# EAGLE design WatchdogTimer (EAGLE 6.3)
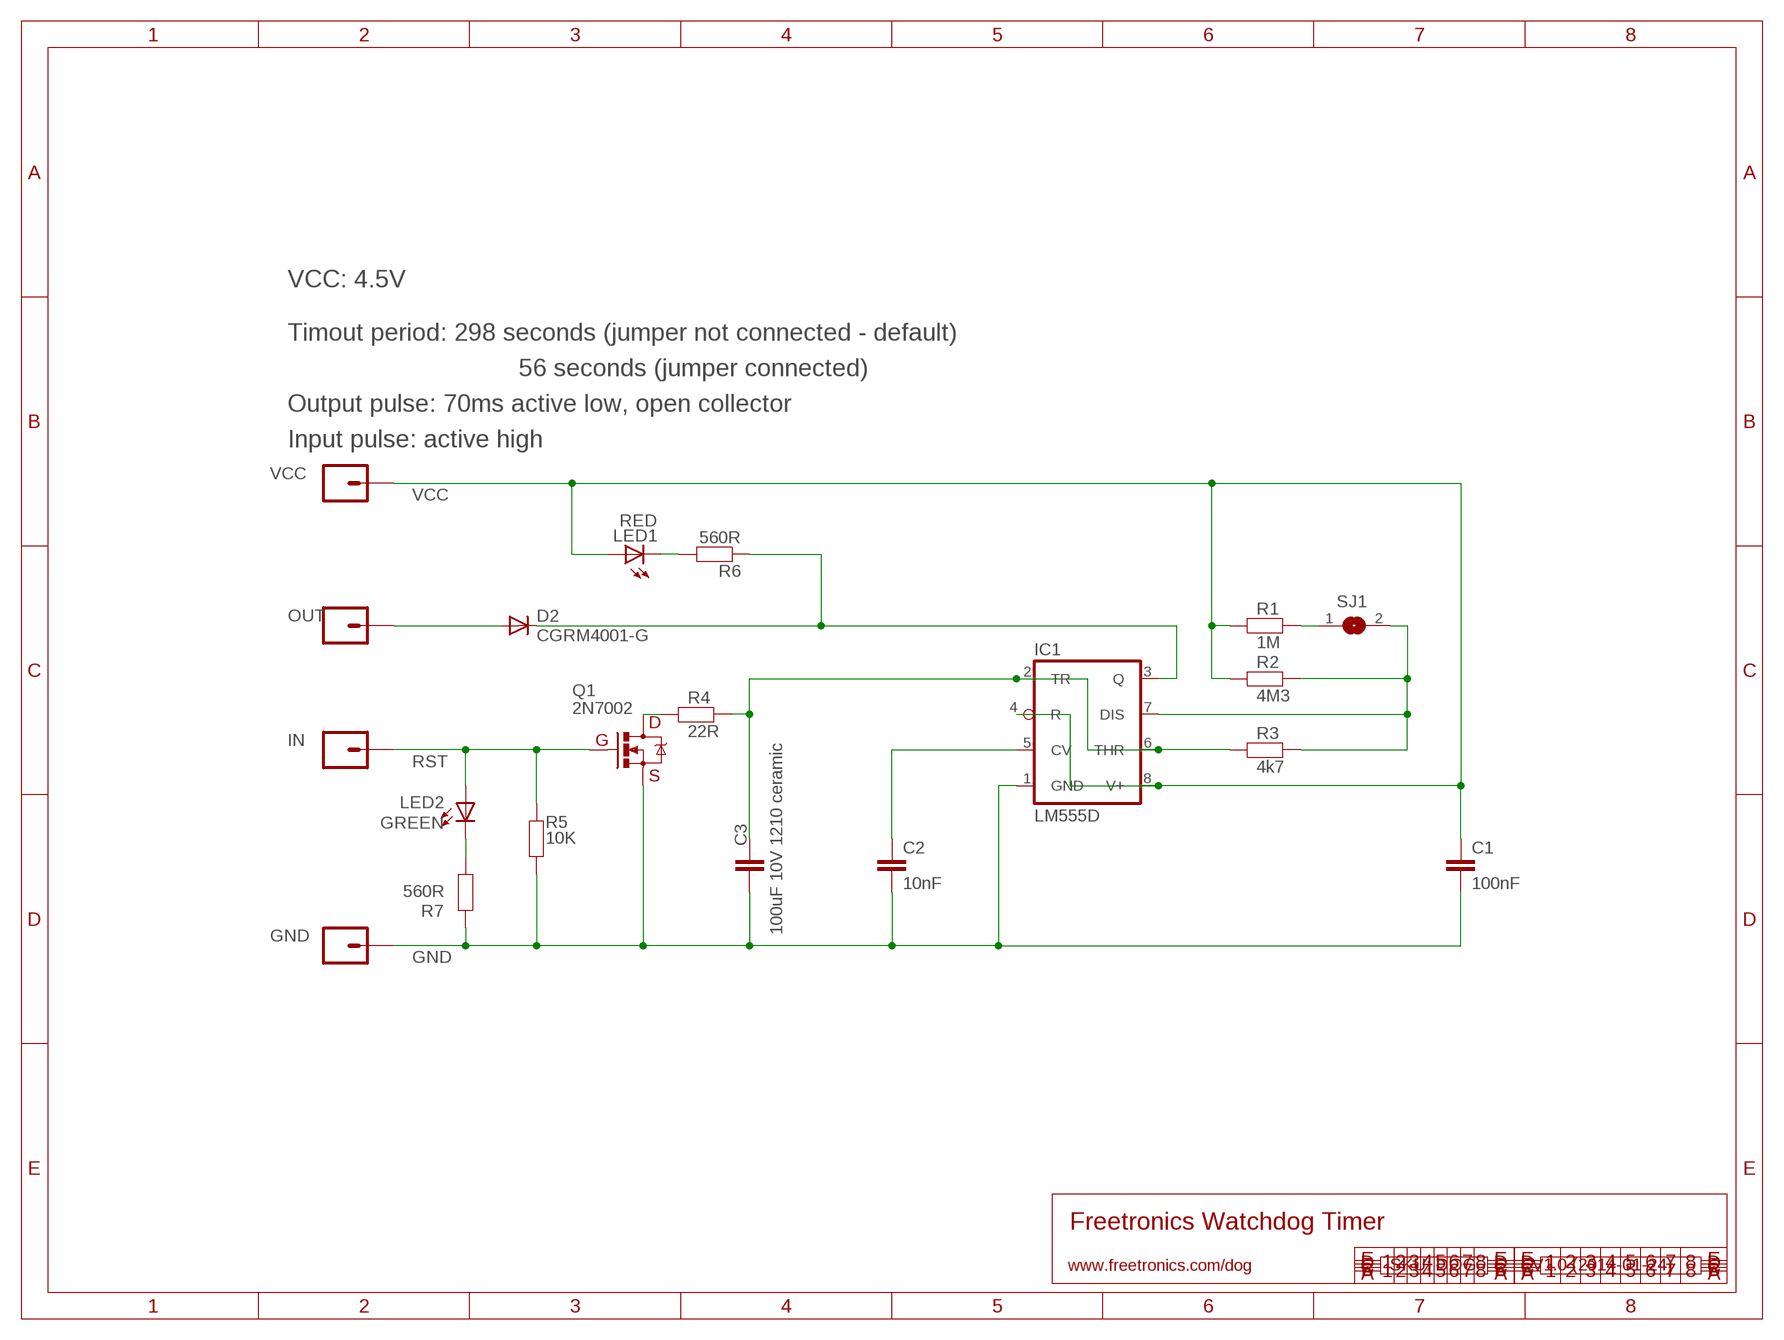
[diagram p0: schematic, sheet 1]

## Parts
C1  100nF  CAP0603  [0603]
C2  10nF  CAP0603  [0603]
C3  100uF 10V 1210 ceramic  C-EUC1210  [C1210]
D2  CGRM4001-G  [SOD-123_MINI-SMA]
GND  M01PTH  [1X01]
IC1  LM555D  [SO08]
IN  M01PTH  [1X01]
LED1  RED  LED0603  [LED-0603]
LED2  GREEN  LED0603  [LED-0603]
OUT  M01PTH  [1X01]
Q1  2N7002  MOSFET-NCHANNELSMD  [SOT23-3]
R1  1M  RESISTOR0603  [0603]
R2  4M3  RESISTOR0603  [0603]
R3  4k7  RESISTOR0603  [0603]
R4  22R  RESISTOR0603  [0603]
R5  10K  RESISTOR0603  [0603]
R6  560R  RESISTOR0603  [0603]
R7  560R  RESISTOR0603  [0603]
SJ1  SJ  [SJ]
VCC  M01PTH  [1X01]

## Nets
C4: C3.1 IC1.2(TR) IC1.6(THR) R3.1 R4.2
GND: C1.2 C2.2 C3.2 GND.1 IC1.1(GND) Q1.2(S) R5.1 R7.2
N$1: Q1.3(D) R4.1
N$2: LED2.C R7.1
N$3: R1.2 SJ1.1
N$4: IC1.7(DIS) R2.2 R3.2 SJ1.2
N$5: LED1.C R6.2
N$6: C2.1 IC1.5(CV)
N$8: D2.A OUT.1
RST: IN.1 LED2.A Q1.1(G) R5.2
TO: D2.C IC1.3(Q) R6.1
VCC: C1.1 IC1.4(R) IC1.8(V+) LED1.A R1.1 R2.1 VCC.1

## Notes on the sheet
- VCC: 4.5V
- Timout period: 298 seconds (jumper not connected - default)
- 56 seconds (jumper connected)
- Output pulse: 70ms active low, open collector
- Input pulse: active high
- D
- G
- S
- Freetronics Watchdog Timer
- www.freetronics.com/dog | SKU: DOG | V1.0 (2014-01-24)

## Library data of the parts
C1 C2 = freetronics-master-v1:CAP: Capacitor Standard 0603 ceramic capacitor, and 0.1" leaded capacitor.
C3 = freetronics-jon:C-EU: CAPACITOR, European symbol
D2 = diode:CGRM400*-G: Molded plasitc,JEDEC SOD-123/Mini SMA Source: Comchip CGRM4001-G.pdf
GND IN OUT VCC = freetronics-master-v1:M01: Header 1 Standard 1-pin 0.1" header. Use with straight break away headers (SKU : PRT-00116), right angle break away headers (PRT-00553), swiss pins (PRT-00743), machine pins (PRT-00117), and female headers (PRT-00115).
IC1 = linear:*555: TIMER
LED1 LED2 = freetronics-original:LED: LEDs Standard schematic elements and footprints for 5mm, 3mm, 1206, and 0603 sized LEDs. 5mm - Spark Fun Electronics SKU : COM-00529 (and others)
Q1 = freetronics-original:MOSFET-NCHANNEL
R1-R7 = freetronics-master-v1:RESISTOR: Resistor Basic schematic elements and footprints for 0603, 1206, and PTH 1/10th watt (small) resistors.
SJ1 = freetronics-master-v1.1:SJ: SMD solder JUMPER

## Board
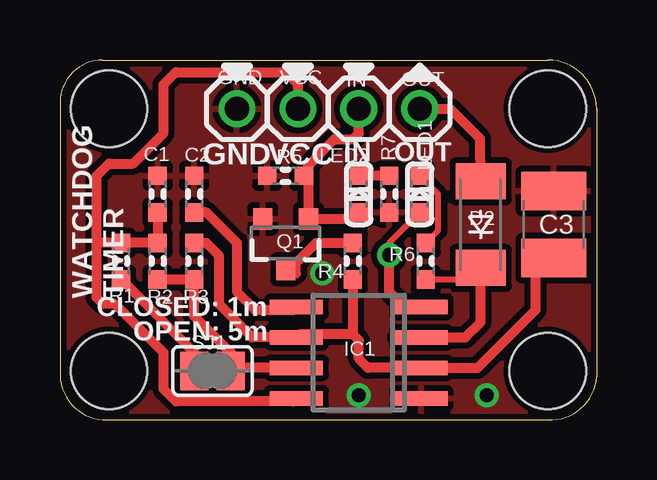
[diagram p1: board, top side]
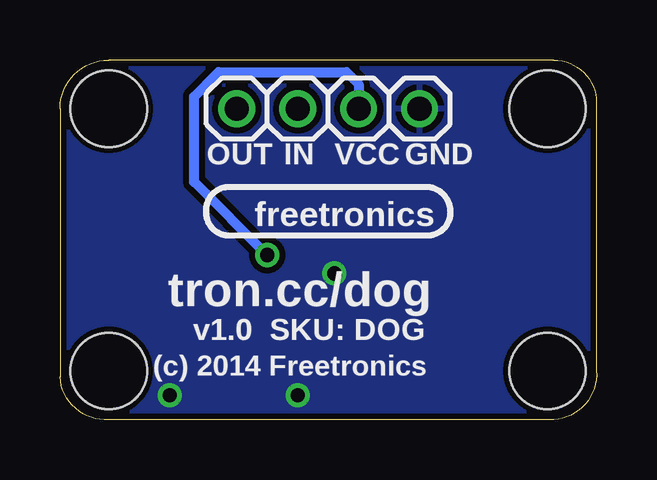
[diagram p2: board, bottom side, seen from below]

Size 22.36 x 14.99 mm. Coordinates in mm from the lower left corner, seen from the top.
Outline: 0,2.04 arc90 1.78,0 20.32,0 arc90 22.36,1.78 22.36,12.96 arc90 20.32,14.99 1.78,14.99 arc90 0,13.21 0,2.04
Copper layers (1*16): Top 0.035mm / dielectric 1.5mm / Bottom 0.035mm
Design rules "default *": minimum track width 8mil, minimum drill 15mil, track to track 10mil, track to pad 10mil, pad to pad 10mil, via to via 10mil, smd to smd 8mil, copper to edge 10mil, drill to drill 8mil, minimum pad ring 10mil, minimum via ring 8mil, stop-mask expansion 4mil, vias tented up to drill 25mil, thermal gap 10mil
Holes 3.17 mm at 2.04,2.04 20.32,2.04 2.04,12.96 20.32,12.96

### Footprints (pad centres in the part's own frame; a part is rotated, then mirrored left to right if it is on the bottom)
0603 = smd 0.762 x 0.762: 1 -0.762,0; 2 0.762,0
C1210 = smd 1.6 x 2.7: 1 -1.4,0; 2 1.4,0
SOD-123_MINI-SMA = smd 1.5 x 2.1: A 1.8,0; C -1.8,0
1X01 = drill 1.016: 1 0,0
SO08 = smd 0.6 x 2.2: 1 -1.905,-2.6; 2 -0.635,-2.6; 3 0.635,-2.6; 4 1.905,-2.6; 5 1.905,2.6; 6 0.635,2.6; 7 -0.635,2.6; 8 -1.905,2.6
LED-0603 = smd 0.762 x 0.762: A -0.762,0; C 0.762,0
SOT23-3 = smd 0.8 x 0.9: 1 -0.95,-1; 2 0.95,-1; 3 0,1.1
SJ = smd 1.168 x 1.6: 1 -0.762,0; 2 0.762,0

### Placement (x,y rotation side)
C1  4.07,9.4 90 top
C2  5.59,9.4 90 top
C3  20.58,8.13 90 top
D2  17.53,8.13 90 top
GND  7.37,12.96 0 top
IC1  12.45,2.8 90 top
IN  12.45,12.96 0 top
LED1  14.99,9.4 90 top
LED2  12.45,9.4 90 top
OUT  14.99,12.96 0 top
Q1  9.4,7.37 180 top
R1  2.54,6.61 270 top
R2  4.07,6.61 270 top
R3  5.59,6.61 270 top
R4  12.2,6.61 270 top
R5  9.4,10.16 0 top
R6  15.24,6.61 90 top
R7  13.72,9.4 270 top
SJ1  6.35,2.04 0 top
VCC  9.91,12.96 0 top

### Tracks (layer width: path | path; a pad name or v marks a point on that pad's centre or on a via)
C4
  Top 0.406: R3.1 6.1,7.37 6.61,6.86 6.61,4.83 8,3.43 IC1.6 9.98,3.56 12.2,3.56 | 12.2,3.56 12.45,3.31 12.45,2.54 12.83,2.16 IC1.2 17.4,2.16 19.82,4.58 19.82,6.22 C3.1 | R4.2 12.2,3.56
GND  (via drill 0.6)
  other vias: 17.78,1.02 12.45,1.02 10.93,6.1
  pour Top: 0,2.04 0,13.21 arc-90 1.78,14.99 20.58,14.99 arc-90 22.36,13.21 22.36,1.78 arc-90 20.58,0 1.78,0 arc-98
  pour Bottom: 0,2.04 0,13.21 arc-90 1.78,14.99 20.58,14.99 arc-90 22.36,13.21 22.36,1.78 arc-90 20.58,0 1.78,0 arc-98
N$1
  Top 0.406: Q1.3 9.83,6.1 9.83,6.52 10.67,7.37 R4.1
N$2
  Top 0.406: R7.1 LED2.C
N$3
  Top 0.406: SJ1.1 5.85,2.54 R1.2
N$4
  Top 0.406: IC1.7 7.5,2.16 SJ1.2 7.12,2.8 5.59,4.32 R3.2 R2.2
N$5
  Top 0.254: R6.2 15.75,7.88 15.75,9.4 LED1.C
N$6
  Top 0.406: IC1.5 9.72,4.58 8.13,4.58 7.37,5.34 7.37,7.37 6.1,8.64 C2.1
N$8
  Top 0.406: D2.A 17.51,11.71 16.26,12.96 OUT.1
RST
  Top 0.406: R5.2 10.34,10.16 | LED2.A 12.18,8.37 Q1.1 10.34,8.39 10.34,10.16 | 10.34,10.16 10.34,10.59 11.43,11.69 12.2,11.69 12.45,11.94 IN.1
TO
  Top 0.254: R6.1 16.79,5.85 D2.C
  Top 0.406: 14.08,3.43 IC1.3 16.89,3.43 17.53,4.07 D2.C
VCC  (via drill 0.6)
  Top 0.254: v13.72,6.86 13.72,7.37 LED1.A
  Top 0.406: IC1.8 9.78,0.89 | 9.91,0.83 IC1.8 | IC1.8 9.72,0.77 4.83,0.77 4.32,1.27 4.32,2.8 2.29,4.83 1.78,4.83 1.53,5.08 1.53,7.37 | 1.53,7.37 R1.1 R2.1 C1.1 | 1.53,7.37 1.53,10.16 2.04,10.67 3.05,10.67 4.32,11.94 4.32,13.97 4.83,14.48 9.4,14.48 9.91,13.97 VCC.1 | IC1.4 14.99,4.76 14.29,4.76 13.72,5.34 v13.72,6.86
  Bottom 0.406: v13.72,6.86 16.77,9.91 16.77,13.47 15.75,14.48 10.42,14.48 9.91,13.97 VCC.1

### Text on the board
tPlace: GND | VCC | IN | OUT | WATCHDOG / TIMER | CLOSED: 1m | OPEN: 5m
bPlace: GND | VCC | IN | OUT | freetronics | tron.cc/dog | v1.0 SKU: DOG | (c) 2014 Freetronics
tDocu: K | K | A | A | A | K